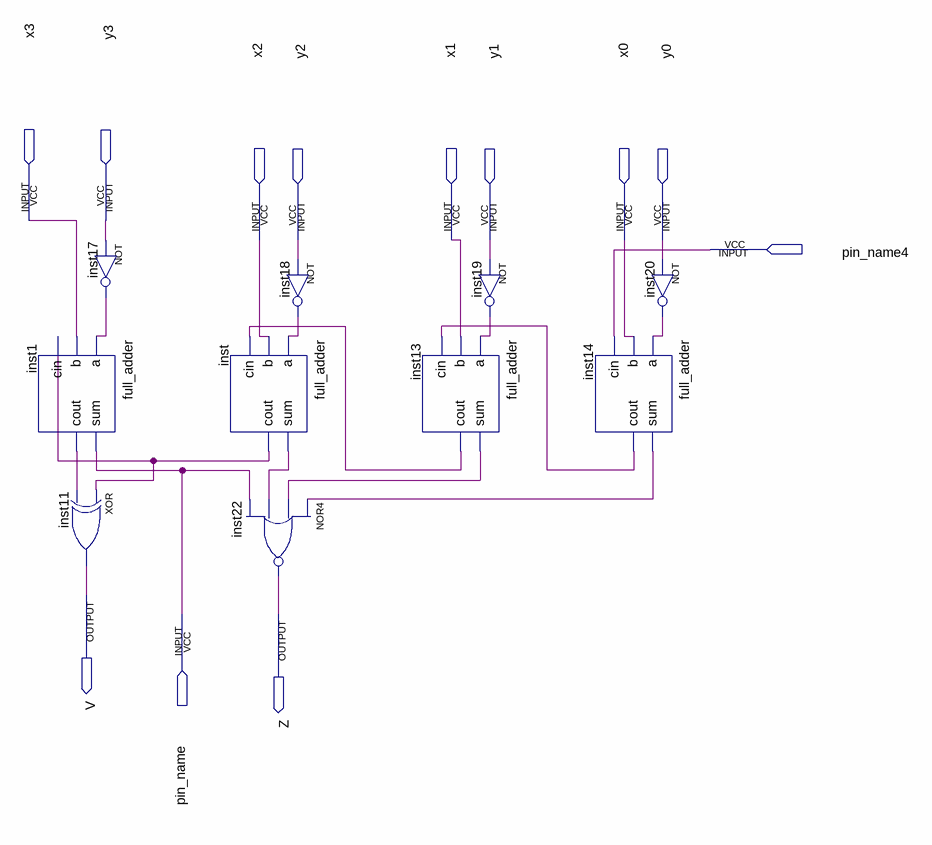
[diagram p0: schematic sheet]
// Quartus schematic exp8.bdf as structural Verilog: 10 symbols, 12 pins
module exp8 (
  input  x3,
  input  y3,
  input  x2,
  input  y2,
  input  x1,
  input  y1,
  input  x0,
  input  y0,
  input  pin_name4,
  input  pin_name,
  output V,
  output Z
);

  wire inst1_cout, inst13_cout, inst13_sum, inst14_cout, inst14_sum, inst17_out, inst18_out, inst19_out,
       inst20_out, inst_cout, inst_sum;

  full_adder inst1 (.a(inst17_out), .b(x3), .cin(inst_cout), .sum(pin_name), .cout(inst1_cout));
  xor inst11 (V, inst_cout, inst1_cout);
  not inst17 (inst17_out, y3);
  full_adder inst (.a(inst18_out), .b(x2), .cin(inst13_cout), .sum(inst_sum), .cout(inst_cout));
  not inst18 (inst18_out, y2);
  nor inst22 (Z, inst14_sum, inst13_sum, inst_sum, pin_name);
  full_adder inst13 (.a(inst19_out), .b(x1), .cin(inst14_cout), .sum(inst13_sum), .cout(inst13_cout));
  not inst19 (inst19_out, y1);
  full_adder inst14 (.a(inst20_out), .b(x0), .cin(pin_name4), .sum(inst14_sum), .cout(inst14_cout));
  not inst20 (inst20_out, y0);
endmodule
